# EAGLE design item_2223_Frontend (EAGLE 9.6.2)
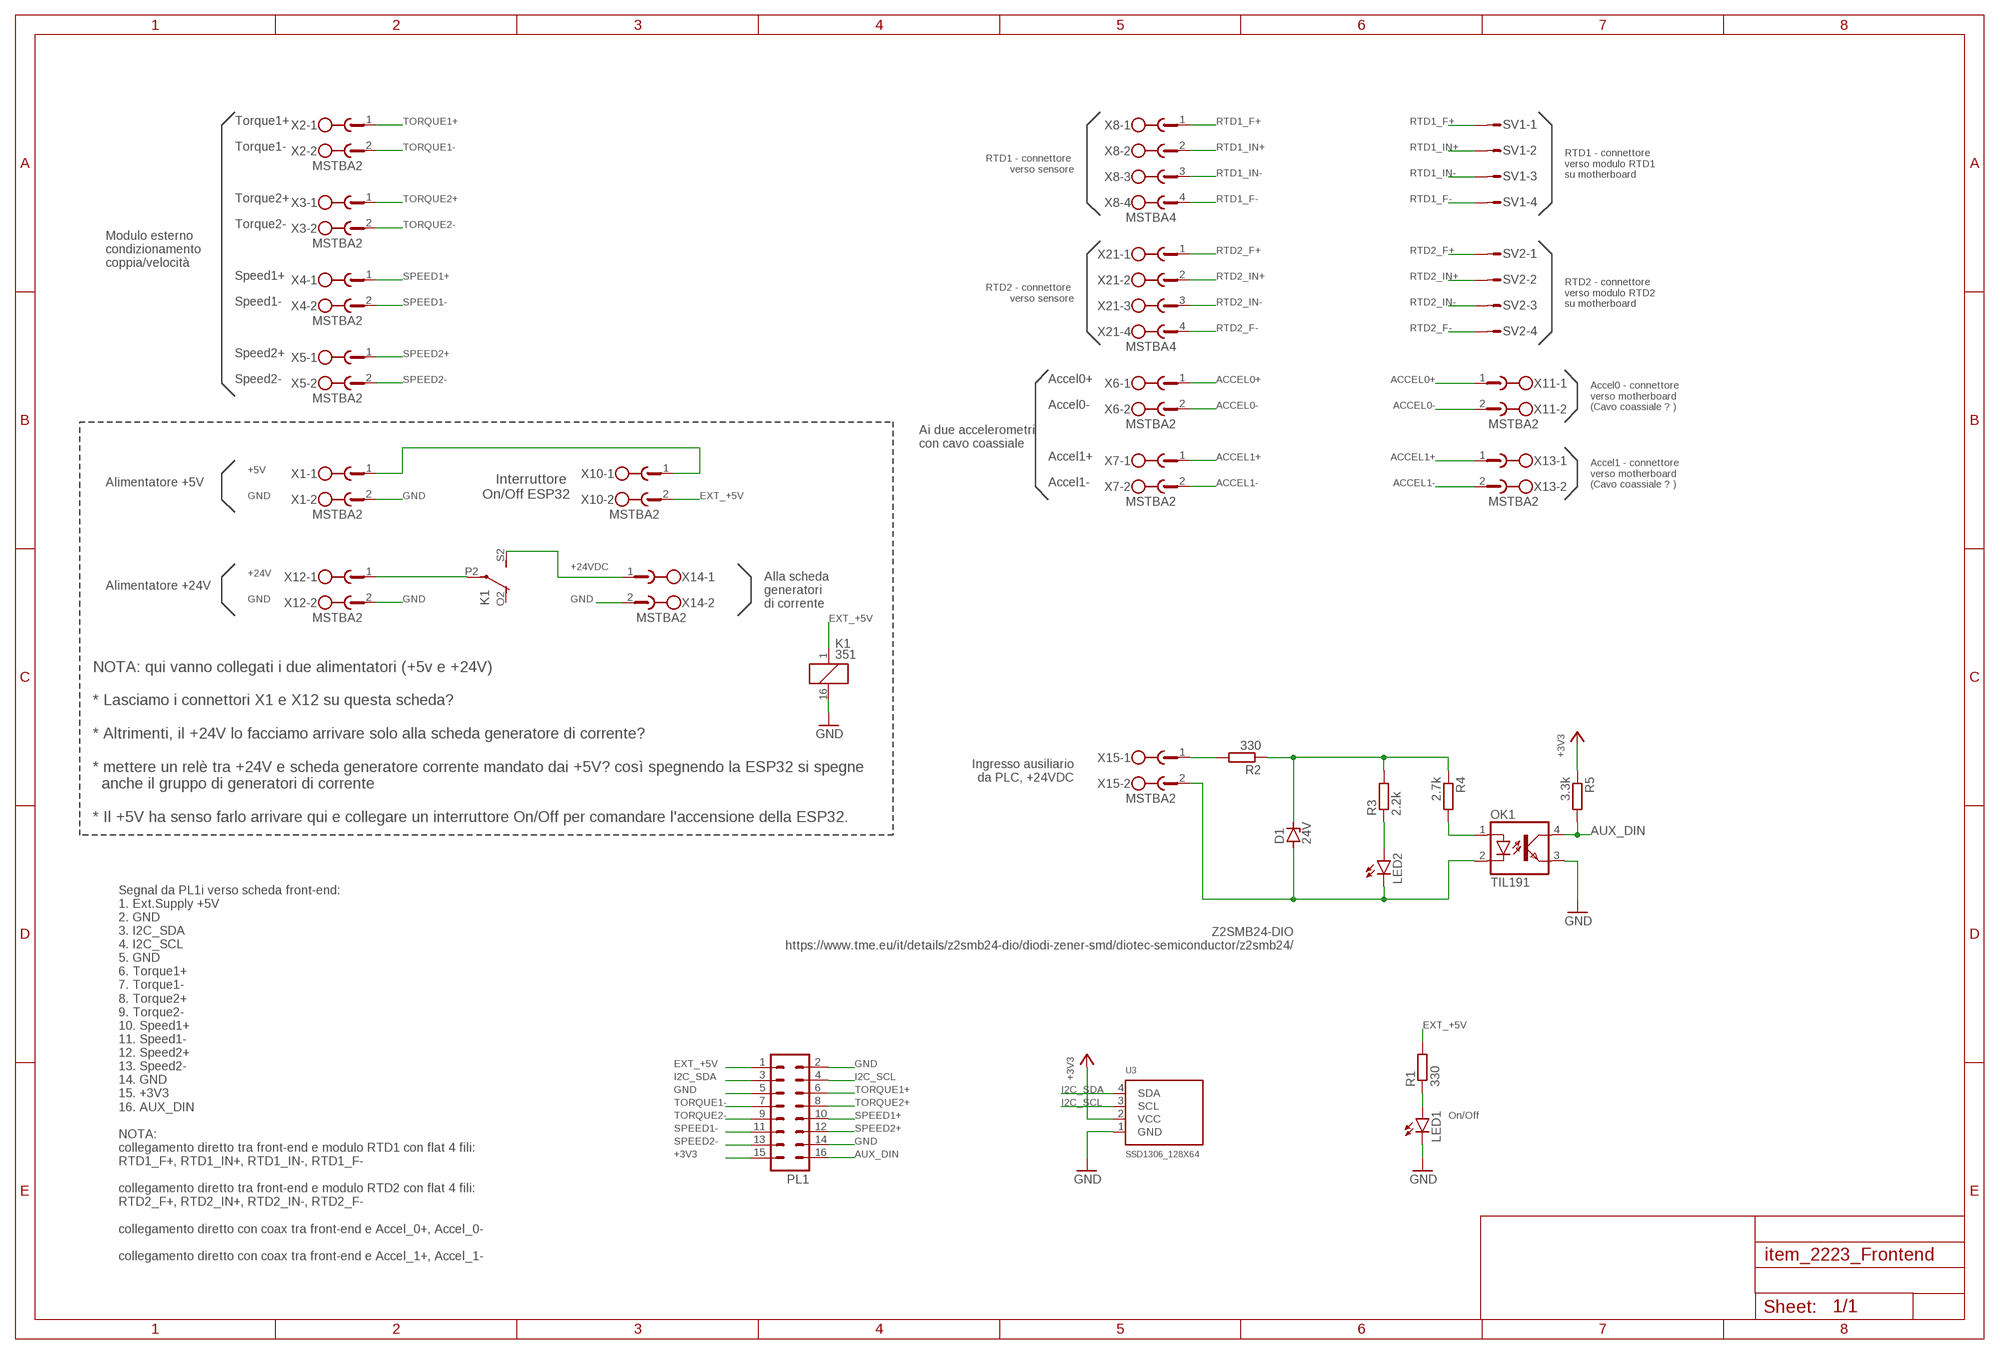
[diagram p0: schematic, sheet 1]

## Parts
D1  24V  ZENER-DIODESMB  [SMB]
K1  351  [351]
LED1  LED5MM  [LED5MM]
LED2  LED5MM  [LED5MM]
OK1  TIL191  [DIL04]
PL1  16H  [16H]
R1  330  R-EU_R0805  [R0805]
R2  330  R-EU_R0805  [R0805]
R3  2.2k  R-EU_R0805  [R0805]
R4  2.7k  R-EU_R0805  [R0805]
R5  3.3k  R-EU_R0805  [R0805]
SV1  S04P  [S04P]
SV2  S04P  [S04P]
U3  SSD1306_128X64  [128X64]
X1  MSTBA2  [MSTBA2]
X2  MSTBA2  [MSTBA2]
X3  MSTBA2  [MSTBA2]
X4  MSTBA2  [MSTBA2]
X5  MSTBA2  [MSTBA2]
X6  MSTBA2  [MSTBA2]
X7  MSTBA2  [MSTBA2]
X8  MSTBA4  [MSTBA4]
X10  MSTBA2  [MSTBA2]
X11  MSTBA2  [MSTBA2]
X12  MSTBA2  [MSTBA2]
X13  MSTBA2  [MSTBA2]
X14  MSTBA2  [MSTBA2]
X15  MSTBA2  [MSTBA2]
X21  MSTBA4  [MSTBA4]

## Nets
+3V3: PL1.15 R5.1 U3.2(VCC)
+24VDC [Power]: K1.S2(3:S) X14.1
ACCEL0+ [Analog]: X6.1 X11.1
ACCEL0- [Analog]: X6.2 X11.2
ACCEL1+ [Analog]: X7.1 X13.1
ACCEL1- [Analog]: X7.2 X13.2
AUX_DIN: OK1.4(COL) PL1.16 R5.2
EXT_+5V [Power]: K1.1 PL1.1 R1.2 X10.2
GND: K1.16 LED1.K(C) OK1.3(EMIT) PL1.2 PL1.5 PL1.14 U3.1(GND) X1.2 X12.2 X14.2
I2C_SCL: PL1.4 U3.3(SCL)
I2C_SDA: PL1.3 U3.4(SDA)
N$1 [Analog]: R2.2 X15.1
N$2 [Power]: X1.1 X10.1
N$3: LED1.A R1.1
N$4 [Analog]: D1.C R2.1 R3.2 R4.1
N$5 [Analog]: D1.A LED2.K(C) OK1.2(C) X15.2
N$6 [Power]: K1.P2(3:P) X12.1
N$8 [Analog]: LED2.A R3.1
N$9 [Analog]: OK1.1(A) R4.2
RTD1_F+ [Analog]: SV1.1 X8.1
RTD1_F- [Analog]: SV1.4 X8.4
RTD1_IN+ [Analog]: SV1.2 X8.2
RTD1_IN- [Analog]: SV1.3 X8.3
RTD2_F+ [Analog]: SV2.1 X21.1
RTD2_F- [Analog]: SV2.4 X21.4
RTD2_IN+ [Analog]: SV2.2 X21.2
RTD2_IN- [Analog]: SV2.3 X21.3
SPEED1+ [Analog]: PL1.10 X4.1
SPEED1- [Analog]: PL1.11 X4.2
SPEED2+ [Analog]: PL1.12 X5.1
SPEED2- [Analog]: PL1.13 X5.2
TORQUE1+ [Analog]: PL1.6 X2.1
TORQUE1- [Analog]: PL1.7 X2.2
TORQUE2+ [Analog]: PL1.8 X3.1
TORQUE2- [Analog]: PL1.9 X3.2
Unconnected: K1.O1(2:O) K1.O2(3:O) K1.P1(2:P) K1.S1(2:S)

## Notes on the sheet
- Torque1+
- Torque1-
- RTD1 - connettore 
  verso sensore
- RTD1 - connettore 
  verso modulo RTD1
  su motherboard
- Torque2+
- Torque2-
- Modulo esterno
  condizionamento
  coppia/velocità
- Speed1+
- RTD2 - connettore 
  verso sensore
- RTD2 - connettore 
  verso modulo RTD2
  su motherboard
- Speed1-
- Speed2+
- Speed2- | Accel0+
- Accel0 - connettore 
  verso motherboard
  (Cavo coassiale ? )
- Accel0-
- Ai due accelerometri
  con cavo coassiale
- Accel1+
- +5V
- Accel1 - connettore 
  verso motherboard
  (Cavo coassiale ? )
- Alimentatore +5V
- Interruttore 
  On/Off ESP32
- Accel1-
- GND
- +24V
- Alimentatore +24V
- Alla scheda 
  generatori
  di corrente
- GND
- Ingresso ausiliario
  da PLC, +24VDC
- NOTA: qui vanno collegati i due alimentatori (+5v e +24V)
  
  * Lasciamo i connettori X1 e X12 su questa scheda?
  
  * Altrimenti, il +24V lo facciamo arrivare solo alla scheda generatore di corrente?
  
  * mettere un relè tra +24V e scheda generatore corrente mandato dai +5V? così spegnendo la ESP32 si spegne
    anche il gruppo di generatori di corrente
  
  * Il +5V ha senso farlo arrivare qui e collegare un interruttore On/Off per comandare l'accensione della ESP32.
- Z2SMB24-DIO
  https://www.tme.eu/it/details/z2smb24-dio/diodi-zener-smd/diotec-semiconductor/z2smb24/
- On/Off
- Segnal da PL1i verso scheda front-end:
  1. Ext.Supply +5V
  2. GND
  3. I2C_SDA
  4. I2C_SCL
  5. GND
  6. Torque1+
  7. Torque1-
  8. Torque2+
  9. Torque2-
  10. Speed1+
  11. Speed1-
  12. Speed2+
  13. Speed2-
  14. GND
  15. +3V3
  16. AUX_DIN
  
  NOTA:
  collegamento diretto tra front-end e modulo RTD1 con flat 4 fili:
  RTD1_F+, RTD1_IN+, RTD1_IN-, RTD1_F-
  
  collegamento diretto tra front-end e modulo RTD2 con flat 4 fili:
  RTD2_F+, RTD2_IN+, RTD2_IN-, RTD2_F-
  
  collegamento diretto con coax tra front-end e Accel_0+, Accel_0-
  
  collegamento diretto con coax tra front-end e Accel_1+, Accel_1-

## Library data of the parts
D1 = diode:ZENER-DIODE: Z-Diode
K1 = relay:351: RELAY 2 x switch, Omron; OC_FARNELL: unknown; OC_NEWARK: unknown
LED1 LED2 = led:LED: LED OSRAM: - CHIPLED LG R971, LG N971, LY N971, LG Q971, LY Q971, LO R971, LY R971 LH N974, LH R974 LS Q976, LO Q976, LY Q976 LO Q996 - Hyper CHIPLED LW Q18S LB Q993, LB Q99A, LB R99A - SideLED LS A670, LO A670, LY A670, LG A670, LP A670 LB A673, LV A673, LT A673, LW A673 LH A674 LY A675 LS A676, LA A676, LO A676, LY A676, LW A676 LS A679, LY A679, LG A679 - Hyper Micro SIDELED® LS Y876, LA Y876, LO Y876, LY Y876 LT Y87S - SmartLED LW L88C, LW L88S LB L89C, LB L89S, LG L890 LS L89K, LO L89K, LY L89K LS L896, LA L896, LO L896, LY L896 - TOPLED LS T670, LO T670, LY T670, LG T670, LP T670 LSG T670, LSP T670, LSY T670, LOP T670, LYG T670 LG T671, LOG T671, LSG T671 LB T673, LV T673, LT T673, LW T673 LH T674 LS T676, LA T676, LO T676, LY T676, LB T676, LH T676, LSB T676, LW T676 LB T67C, LV T67C, LT T67C, LS T67K, LO T67K, LY T67K, LW E67C LS E67B, LA E67B, LO E67B, LY E67B, LB E67C, LV E67C, LT E67C LW T67C LS T679, LY T679, LG T679 LS T770, LO T770, LY T770, LG T770, LP T770 LB T773, LV T773, LT T773, LW T773 LH T774 LS E675, LA E675, LY E675, LS T675 LS T776, LA T776, LO T776, LY T776, LB T776 LHGB T686 LT T68C, LB T68C - Hyper Mini TOPLED® LB M676 - Mini TOPLED Santana® LG M470 LS M47K, LO M47K, LY M47K Source: http://www.osram.convergy.de LUXEON: - LUMILED® LXK2-PW12-R00, LXK2-PW12-S00, LXK2-PW14-U00, LXK2-PW14-V00 LXK2-PM12-R00, LXK2-PM12-S00, LXK2-PM14-U00 LXK2-PE12-Q00, LXK2-PE12-R00, LXK2-PE12-S00, LXK2-PE14-T00, LXK2-PE14-U00 LXK2-PB12-K00, LXK2-PB12-L00, LXK2-PB12-M00, LXK2-PB14-N00, LXK2-PB14-P00, LXK2-PB14-Q00 LXK2-PR12-L00, LXK2-PR12-M00, LXK2-PR14-Q00, LXK2-PR14-R00 LXK2-PD12-Q00, LXK2-PD12-R00, LXK2-PD12-S00 LXK2-PH12-R00, LXK2-PH12-S00 LXK2-PL12-P00, LXK2-PL12-Q00, LXK2-PL12-R00 Source: www.luxeon.com KINGBRIGHT: KA-3528ASYC Source: www.kingbright.com
OK1 = optocoupler:TIL191: TEXAS INSTRUMENTS OPTO COUPLER; OC_FARNELL: 1683363; OC_NEWARK: unknown
PL1 = con-harting-h:16H: CONNECTOR; OC_FARNELL: unknown; OC_NEWARK: unknown
R1-R5 = rcl:R-EU_: RESISTOR, European symbol; SPICEPREFIX: R
SV1 SV2 = con-amp-mt:S04P: AMP MT CONNECTOR; OC_FARNELL: unknown; OC_NEWARK: unknown
U3 = ssd1306oled:SSD1306_128X64: OLED Display Board 0.91" 128x64 White I2C - 4 Pins - SSD1306
X1-X7 X10-X15 = con-phoenix-508:MSTBA2: PHOENIX; MF: FARNELL; MPN: 1757242; OC_FARNELL: 3705171; OC_NEWARK: 71C4161
X8 X21 = con-phoenix-508:MSTBA4: PHOENIX; MF: FARNELL; MPN: 1757268; OC_FARNELL: 3705195; OC_NEWARK: 71C4163

## Net classes
0 default: width 0.406 mm, drill 0.305 mm, clearance 0.406 mm
1 Power: width 1.397 mm, drill 0.305 mm, clearance 0.406 mm
2 Analog: width 0.889 mm, drill 0.305 mm, clearance 0.406 mm

## Board
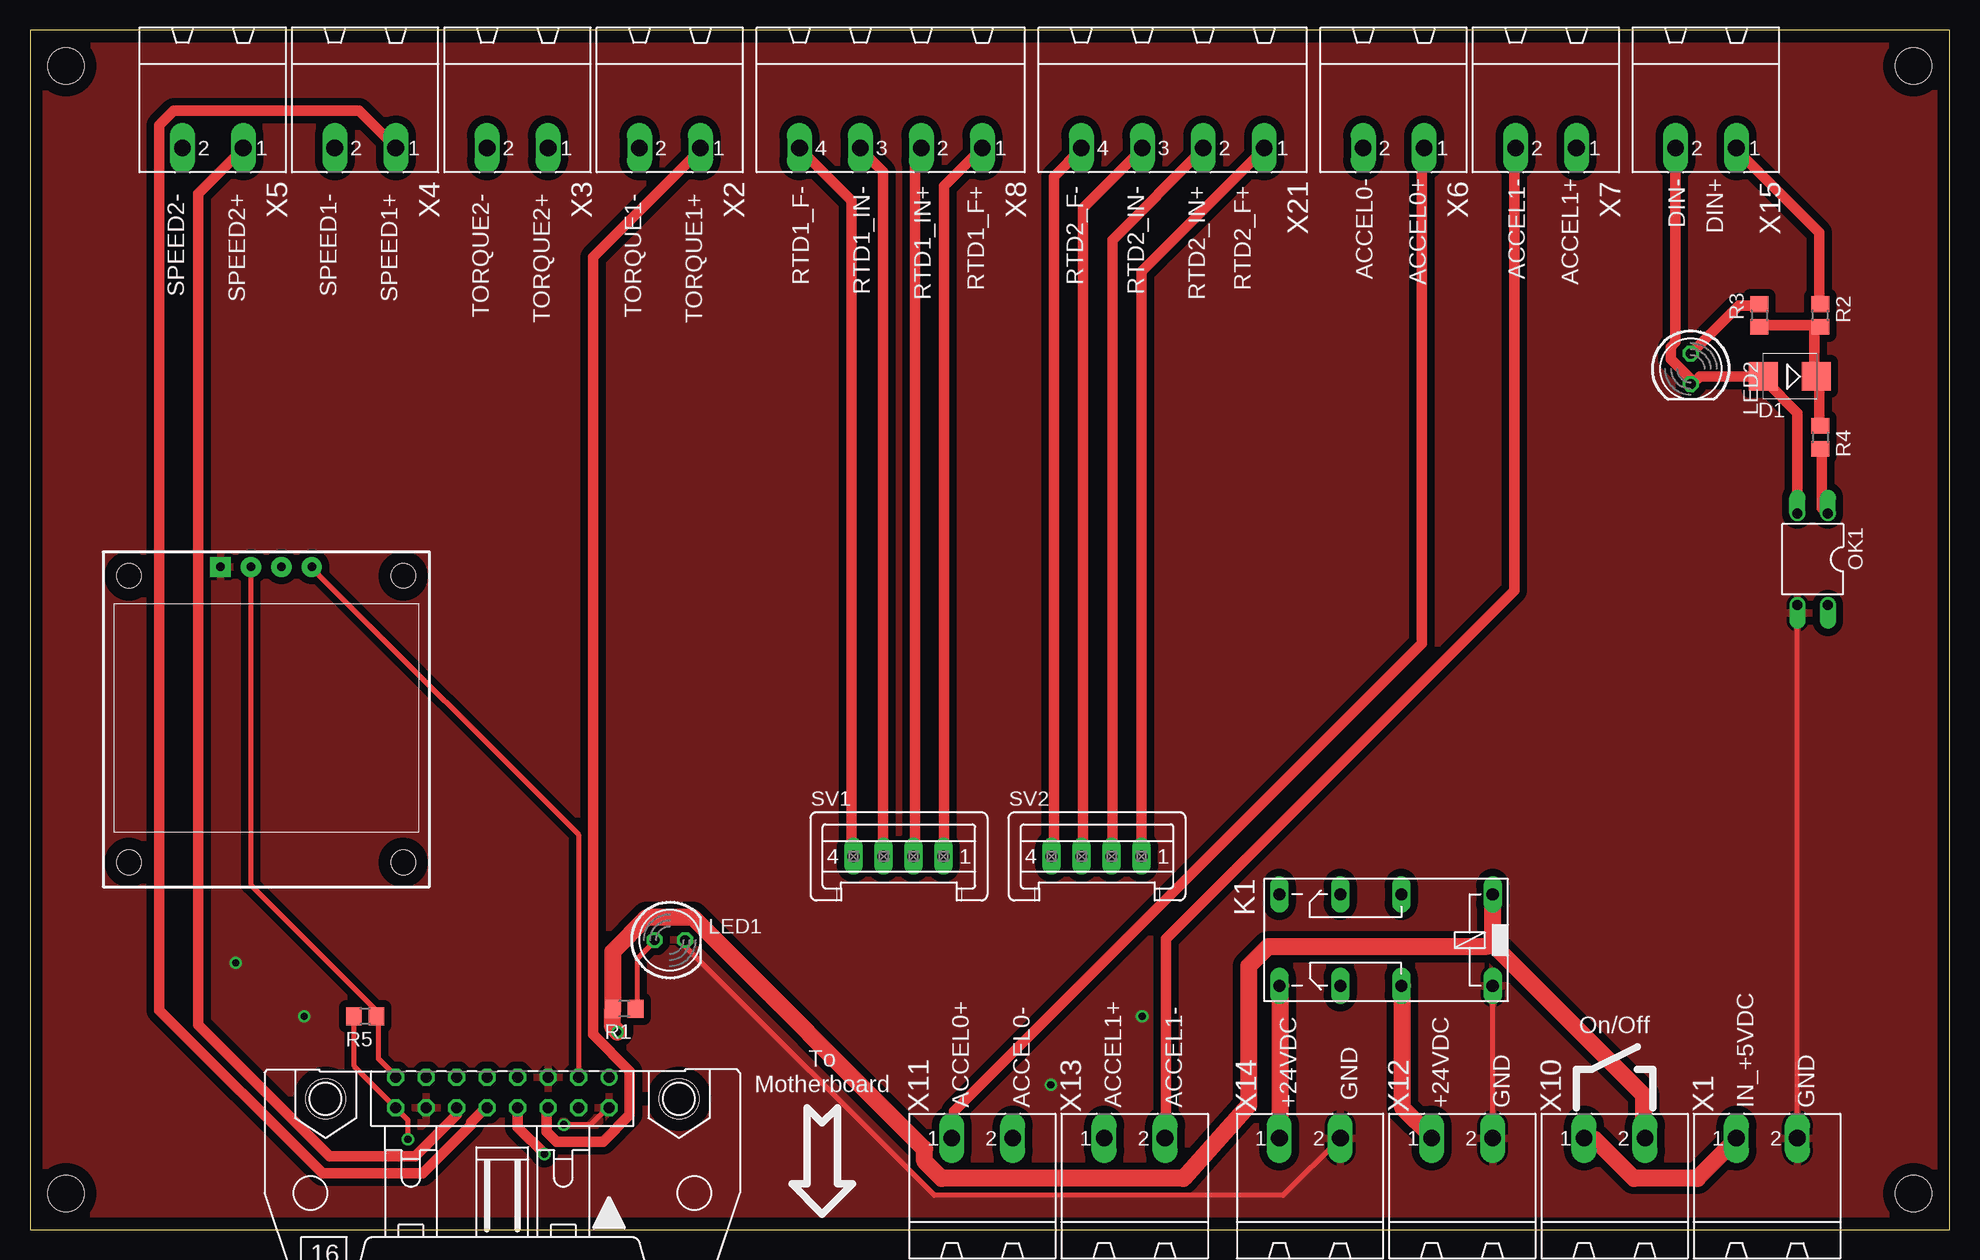
[diagram p1: board, top side]
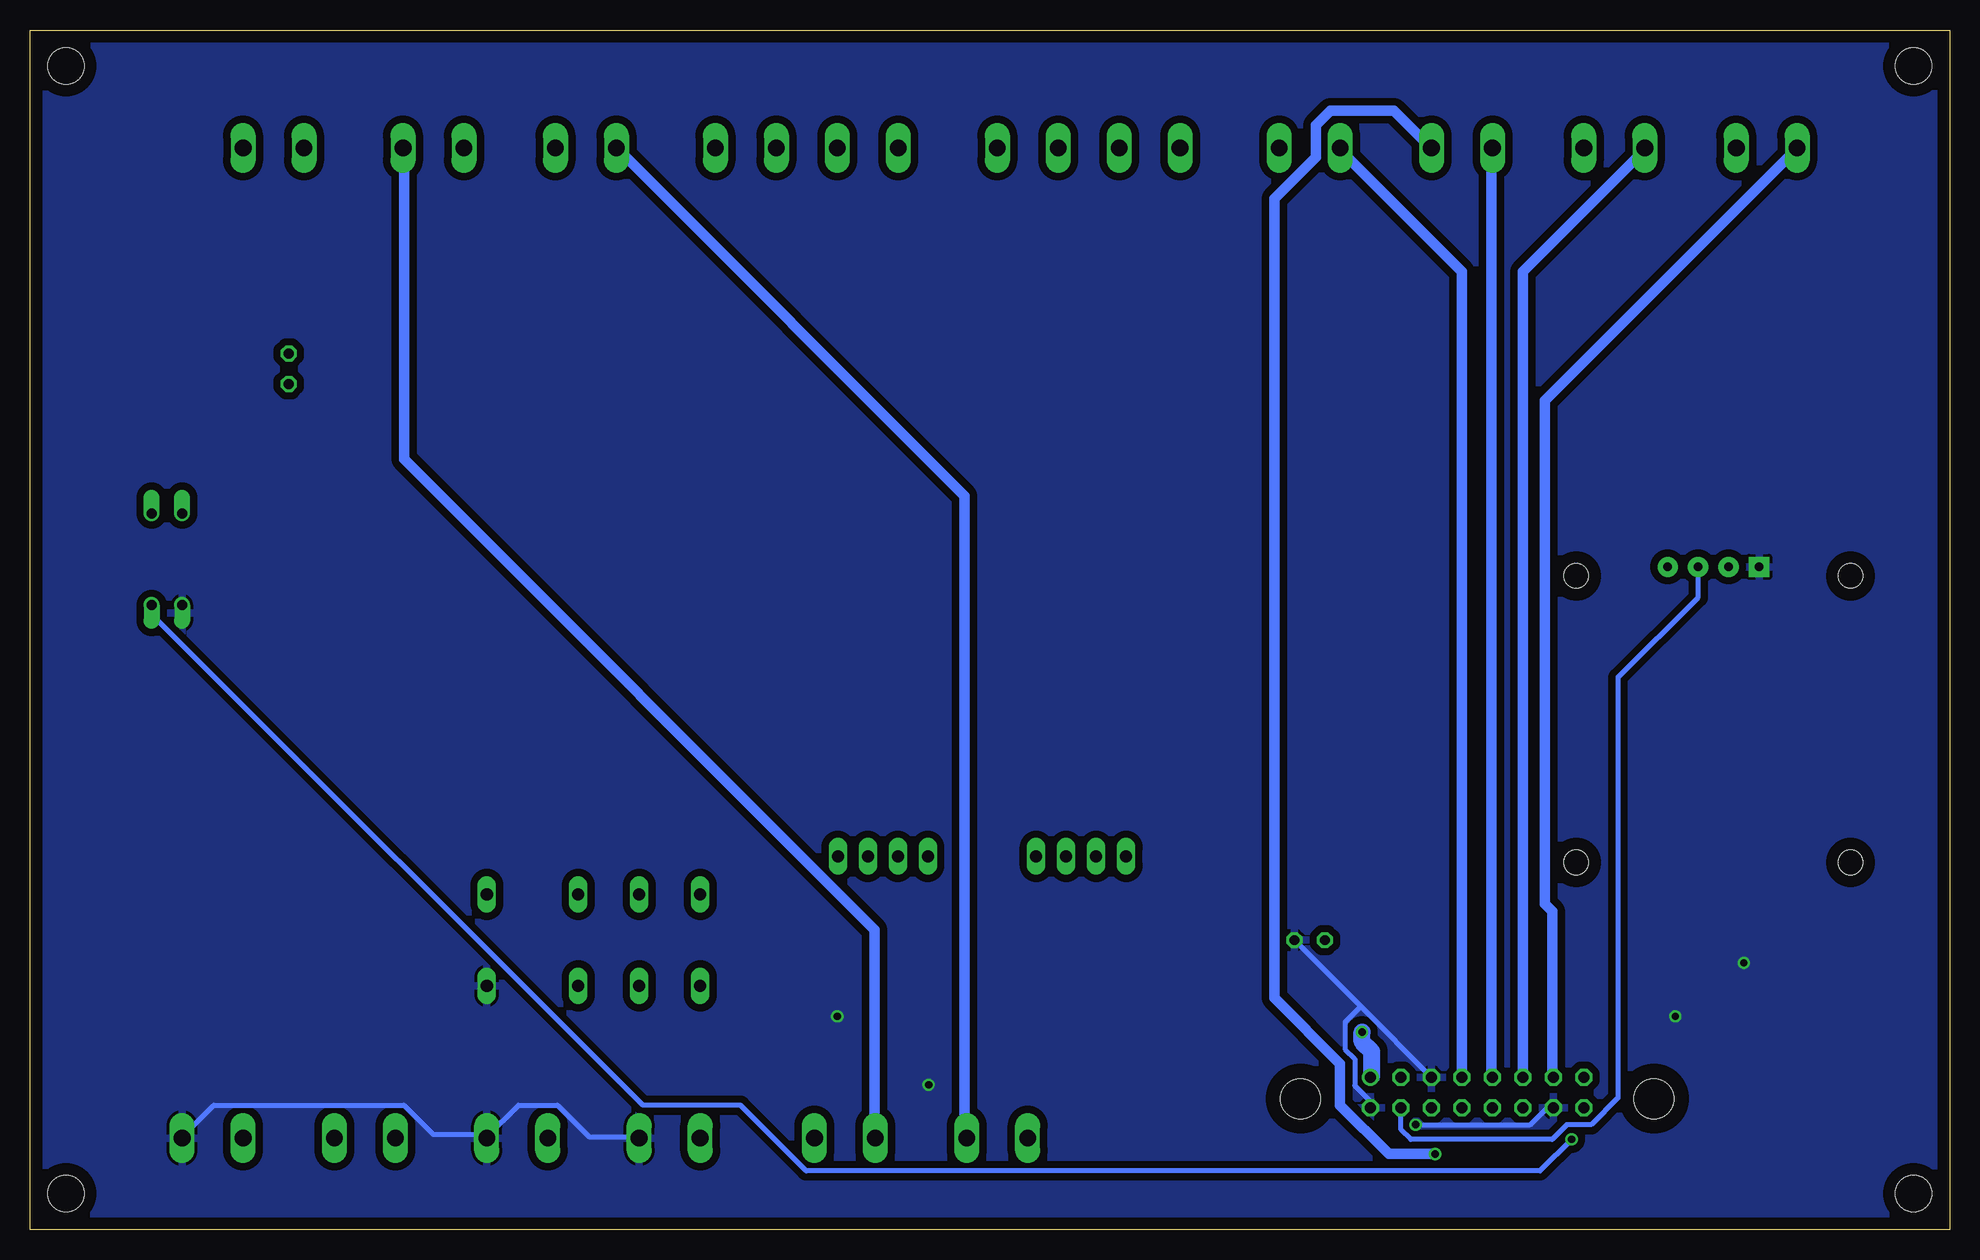
[diagram p2: board, bottom side, seen from below]

Size 160 x 100 mm. Coordinates in mm from the lower left corner, seen from the top.
Outline: 0,0 160,0 160,100 0,100 0,0
Copper layers (1*16): Top 0.035mm / dielectric 1.5mm / Bottom 0.035mm
Design rules "default": minimum track width 10mil, minimum drill 24mil, track to track 8mil, track to pad 8mil, pad to pad 8mil, via to via 8mil, smd to smd 8mil, copper to edge 40mil, drill to drill 8mil, minimum pad ring 10mil, minimum via ring 8mil, stop-mask expansion 4mil, vias tented up to drill 0mil, thermal gap 10mil
Holes 3 mm at 3,3 3,97 157,97 157,3
tKeepout: area -3.2,98.4 to 163.2,102.2; area 158.8,-3.2 to 163.2,98.4; area -3.2,-2.5 to 1.3,98.4; area 1.3,-2.5 to 160,1.3
bKeepout: area -3.2,98.4 to 163.2,102.2; area 158.8,-3.2 to 163.2,98.4; area 1.3,-2.5 to 160,1.3; area -3.2,-2.5 to 1.3,98.4

### Footprints (pad centres in the part's own frame; a part is rotated, then mirrored left to right if it is on the bottom)
SMB = smd 2.4 x 2.4: A 2.2,0; C -2.2,0
351 = drill 1.016 long: 1 -3.81,-3.81; 16 -3.81,3.81; O1 8.89,-3.81; O2 8.89,3.81; P1 3.81,-3.81; P2 3.81,3.81; S1 13.97,-3.81; S2 13.97,3.81
LED5MM = drill 0.813 octagon: A -1.27,0; K 1.27,0
DIL04 = drill 0.813 offset: 1 -1.27,-3.81; 2 1.27,-3.81; 3 1.27,3.81; 4 -1.27,3.81
16H = drill 0.914: 1 -8.89,-1.27 | drill 0.914 octagon: 2 -8.89,1.27; 3 -6.35,-1.27; 4 -6.35,1.27; 5 -3.81,-1.27; 6 -3.81,1.27; 7 -1.27,-1.27; 8 -1.27,1.27; 9 1.27,-1.27; 10 1.27,1.27; 11 3.81,-1.27; 12 3.81,1.27; 13 6.35,-1.27; 14 6.35,1.27; 15 8.89,-1.27; 16 8.89,1.27 | hole 3.302: -14.732,0.533; 14.732,0.533
R0805 = smd 1.3 x 1.5: 1 -0.95,0; 2 0.95,0
S04P = drill 1.016 long: 1 3.75,0; 2 1.25,0; 3 -1.25,0; 4 -3.75,0
128X64 = drill 0.7 pad 1.676 square: 1 -3.81,12.7 | drill 0.7 pad 1.676: 2 -1.27,12.7; 3 1.27,12.7; 4 3.81,12.7 | hole 2.032: -11.43,11.938; -11.43,-11.938; 11.43,11.938; 11.43,-11.938
MSTBA2 = drill 1.397 long: 1 -2.54,5.08; 2 2.54,5.08
MSTBA4 = drill 1.397 long: 1 -7.62,5.08; 2 -2.54,5.08; 3 2.54,5.08; 4 7.62,5.08

### Placement (x,y rotation side)
D1  146.69,71.12 180 top
K1  118.11,24.13 180 top
LED1  53.34,24.13 0 top
LED2  138.43,71.75 270 top
OK1  148.59,55.88 180 top
PL1  39.37,11.43 180 top
R1  49.53,18.41 180 top
R2  149.22,76.2 90 top
R3  144.15,76.2 270 top
R4  149.22,66.04 270 top
R5  27.94,17.78 180 top
SV1  72.39,31.11 0 top
SV2  88.9,31.11 0 top
U3  19.68,42.55 0 top
X1  144.78,2.54 0 top
X2  53.34,95.25 180 top
X3  40.64,95.25 180 top
X4  27.94,95.25 180 top
X5  15.24,95.25 180 top
X6  113.67,95.25 180 top
X7  126.36,95.25 180 top
X8  71.75,95.25 180 top
X10  132.08,2.54 0 top
X11  79.38,2.54 0 top
X12  119.38,2.54 0 top
X13  92.08,2.54 0 top
X14  106.68,2.54 0 top
X15  139.7,95.25 180 top
X21  95.25,95.25 180 top

### Tracks (layer width: path | path; a pad name or v marks a point on that pad's centre or on a via)
+3V3
  Top 0.406: PL1.15 30.48,12.8 29.06,14.22 29.06,17.68 R5.1 28.85,17.88 28.85,18.29 18.41,28.73 U3.2
+24VDC
  Top 1.397: K1.S2 104.24,20.32 104.24,7.72 X14.1
ACCEL0+
  Top 0.889: X11.1 77.01,7.72 77.01,9.86 116.03,48.87 116.03,90.02 X6.1
ACCEL0-
  Bottom 0.889: X11.2 82.09,7.72 82.09,61.16 110.95,90.02 X6.2
ACCEL1+
  Bottom 0.889: X13.1 89.61,7.72 89.61,24.99 128.83,64.21 128.83,90.02 X7.1
ACCEL1-
  Top 0.889: X13.2 94.69,7.72 94.69,24.23 123.75,53.29 123.75,90.02 X7.2
AUX_DIN  (via drill 0.61)
  Top 0.406: R5.2 27.03,17.68 27.03,13.61 PL1.16 31.5,9.14 v31.5,7.52
  Bottom 0.406: v31.5,7.52 34.14,4.88 95.3,4.88 100.79,10.36 108.92,10.36 149.76,51.21 149.76,52.02 OK1.4
EXT_+5V  (via drill 0.61)
  Top 1.397: v48.97,16.46 48.56,16.87 48.56,18.29 R1.2 48.56,19.1 48.56,23.16 51.41,26.01 55.27,26.01 74.57,6.71 74.57,5.69 76,4.27 96.14,4.27 101.58,10.34 101.58,21.95 103.2,23.57 121.31,23.57 121.92,23.77 | 121.92,23.77 K1.1 | 121.92,23.77 134.52,11.18 134.52,7.72 X10.2
  Bottom 1.397: v48.97,16.46 48.97,15.65 48.16,14.83 48.16,12.8 PL1.1
GND  (via drill 0.6, 0.61)
  Top 0.406: v44.5,8.74 46.74,8.74 48.16,10.16 PL1.2 | X12.2 K1.16 | X1.2 OK1.3 | X14.2 104.44,2.85 75.39,2.85 54.66,23.57 54.66,23.98 LED1.K
  Bottom 0.406: PL1.14 33.53,10.16 34.95,8.74 v44.5,8.74 | PL1.5 49.07,18.59 | 49.07,18.59 LED1.K | 49.07,18.59 50.39,17.27 50.39,15.04 49.58,14.22 49.58,11.99 48.36,10.77 48.36,10.16 PL1.2 | X14.2 109.32,7.72 113.39,7.72 116.03,10.36 119.28,10.36 121.92,7.72 X12.2 121.92,7.92 126.39,7.92 128.83,10.36 144.68,10.36 147.32,7.72 X1.2
  other vias: 17.14,22.23 22.86,17.78 85.09,12.06 92.71,17.78
  pour Bottom (isolate 0.61): -5.08,102.87 165.1,102.87 165.1,-4.45 -5.08,-4.45
  pour Top (isolate 0.61): -4.45,103.5 164.47,103.5 164.47,-4.45 -4.45,-4.45
I2C_SCL
  Bottom 0.406: PL1.4 45.72,8.33 44.91,7.52 33.12,7.52 31.9,8.74 29.87,8.74 27.64,10.97 27.64,46.02 20.95,52.7 U3.3
I2C_SDA
  Top 0.406: PL1.3 45.72,32.92 23.5,55.14 U3.4
N$1
  Top 0.889: R2.2 149.15,77.22 149.15,83.11 142.24,90.02 X15.1
N$2
  Top 1.397: X10.1 129.64,7.52 130.45,7.52 133.71,4.27 138.99,4.27 142.24,7.52 X1.1
N$3
  Top 0.406: R1.1 50.6,18.49 50.6,22.55 52.02,23.98 LED1.A
N$4
  Top 0.889: R3.2 144.27,75.39 149.15,75.39 R2.1 148.74,74.98 148.74,71.53 D1.C 148.95,71.12 149.15,70.92 149.15,67.06 R4.1
N$5
  Top 0.889: OK1.2 147.32,68.07 144.68,70.71 D1.A 139.19,71.12 138.58,70.51 LED2.K 138.38,70.92 136.75,72.54 136.75,73.56 137.16,73.97 X15.2
N$6
  Top 1.397: K1.P2 114.4,20.32 114.4,10.16 116.84,7.72 X12.1
N$8
  Top 0.889: R3.1 144.07,77.01 142.44,77.01 138.58,73.15 LED2.A
N$9
  Top 0.889: R4.2 149.35,65.02 149.35,60.15 149.76,59.74 OK1.1
RTD1_F+
  Top 0.889: SV1.1 76.2,31.29 76.2,86.97 79.25,90.02 X8.1
RTD1_F-
  Top 0.889: SV1.4 68.48,31.29 68.48,85.75 64.21,90.02 X8.4
RTD1_IN+
  Top 0.889: SV1.2 73.76,31.29 73.76,89.61 74.17,90.02 X8.2
RTD1_IN-
  Top 0.889: SV1.3 71.12,31.29 71.12,88.19 69.29,90.02 X8.3
RTD2_F+
  Top 0.889: SV2.1 92.66,31.29 92.66,79.86 102.82,90.02 X21.1
RTD2_F-
  Top 0.889: SV2.4 85.34,31.29 85.34,87.78 87.58,90.02 X21.4
RTD2_IN+
  Top 0.889: SV2.2 90.22,31.29 90.22,82.5 97.74,90.02 X21.2
RTD2_IN-
  Top 0.889: SV2.3 87.78,31.29 87.78,85.14 92.66,90.02 X21.3
SPEED1+
  Top 0.889: PL1.10 38,10.16 36.78,8.94 36.78,8.74 32.72,4.67 24.38,4.67 10.77,18.29 10.77,92.05 11.99,93.27 27.43,93.27 30.48,90.22 X4.1
SPEED1-
  Bottom 0.889: PL1.11 35.56,79.86 25.4,90.02 X4.2
SPEED2+
  Top 0.889: PL1.12 35.56,9.55 32.11,6.1 24.99,6.1 14.02,17.07 14.02,86.36 17.68,90.02 X5.1
SPEED2-
  Bottom 0.889: PL1.13 33.12,12.8 33.12,26.52 33.73,27.13 33.73,69.09 12.8,90.02 X5.2
TORQUE1+
  Top 0.889: PL1.6 43.08,10.16 43.08,8.13 43.89,7.32 47.75,7.32 49.99,9.55 49.99,13.21 46.94,16.26 46.94,81.08 55.88,90.02 X2.1
TORQUE1-
  Bottom 0.889: PL1.7 40.64,79.86 50.8,90.02 X2.2
TORQUE2+  (via drill 0.61)
  Top 0.889: PL1.8 40.64,8.53 v42.88,6.3
  Bottom 0.889: v42.88,6.3 46.74,6.3 50.8,10.36 50.8,13.82 56.29,19.3 56.29,85.95 52.83,89.41 52.83,92.05 51.61,93.27 46.33,93.27 43.28,90.22 X3.1
TORQUE2-
  Bottom 0.889: PL1.9 38.2,12.8 38.2,90.02 X3.2

### Text on the board
tNames: ACCEL0- | ACCEL0+ | ACCEL1- | ACCEL1+ | DIN- | DIN+ | RTD1_F- | RTD1_IN- | RTD1_IN+ | RTD1_F+ | RTD2_F- | RTD2_IN- | RTD2_IN+ | RTD2_F+ | SPEED2- | SPEED2+ | SPEED1- | SPEED1+ | TORQUE2- | TORQUE2+ | TORQUE1- | TORQUE1+ | On/Off | To / Motherboard | GND | ACCEL0+ | ACCEL0- | ACCEL1+ | ACCEL1- | +24VDC | +24VDC | GND | IN_+5VDC | GND